# Altium project Core_FOC_F4_base.PrjPcb
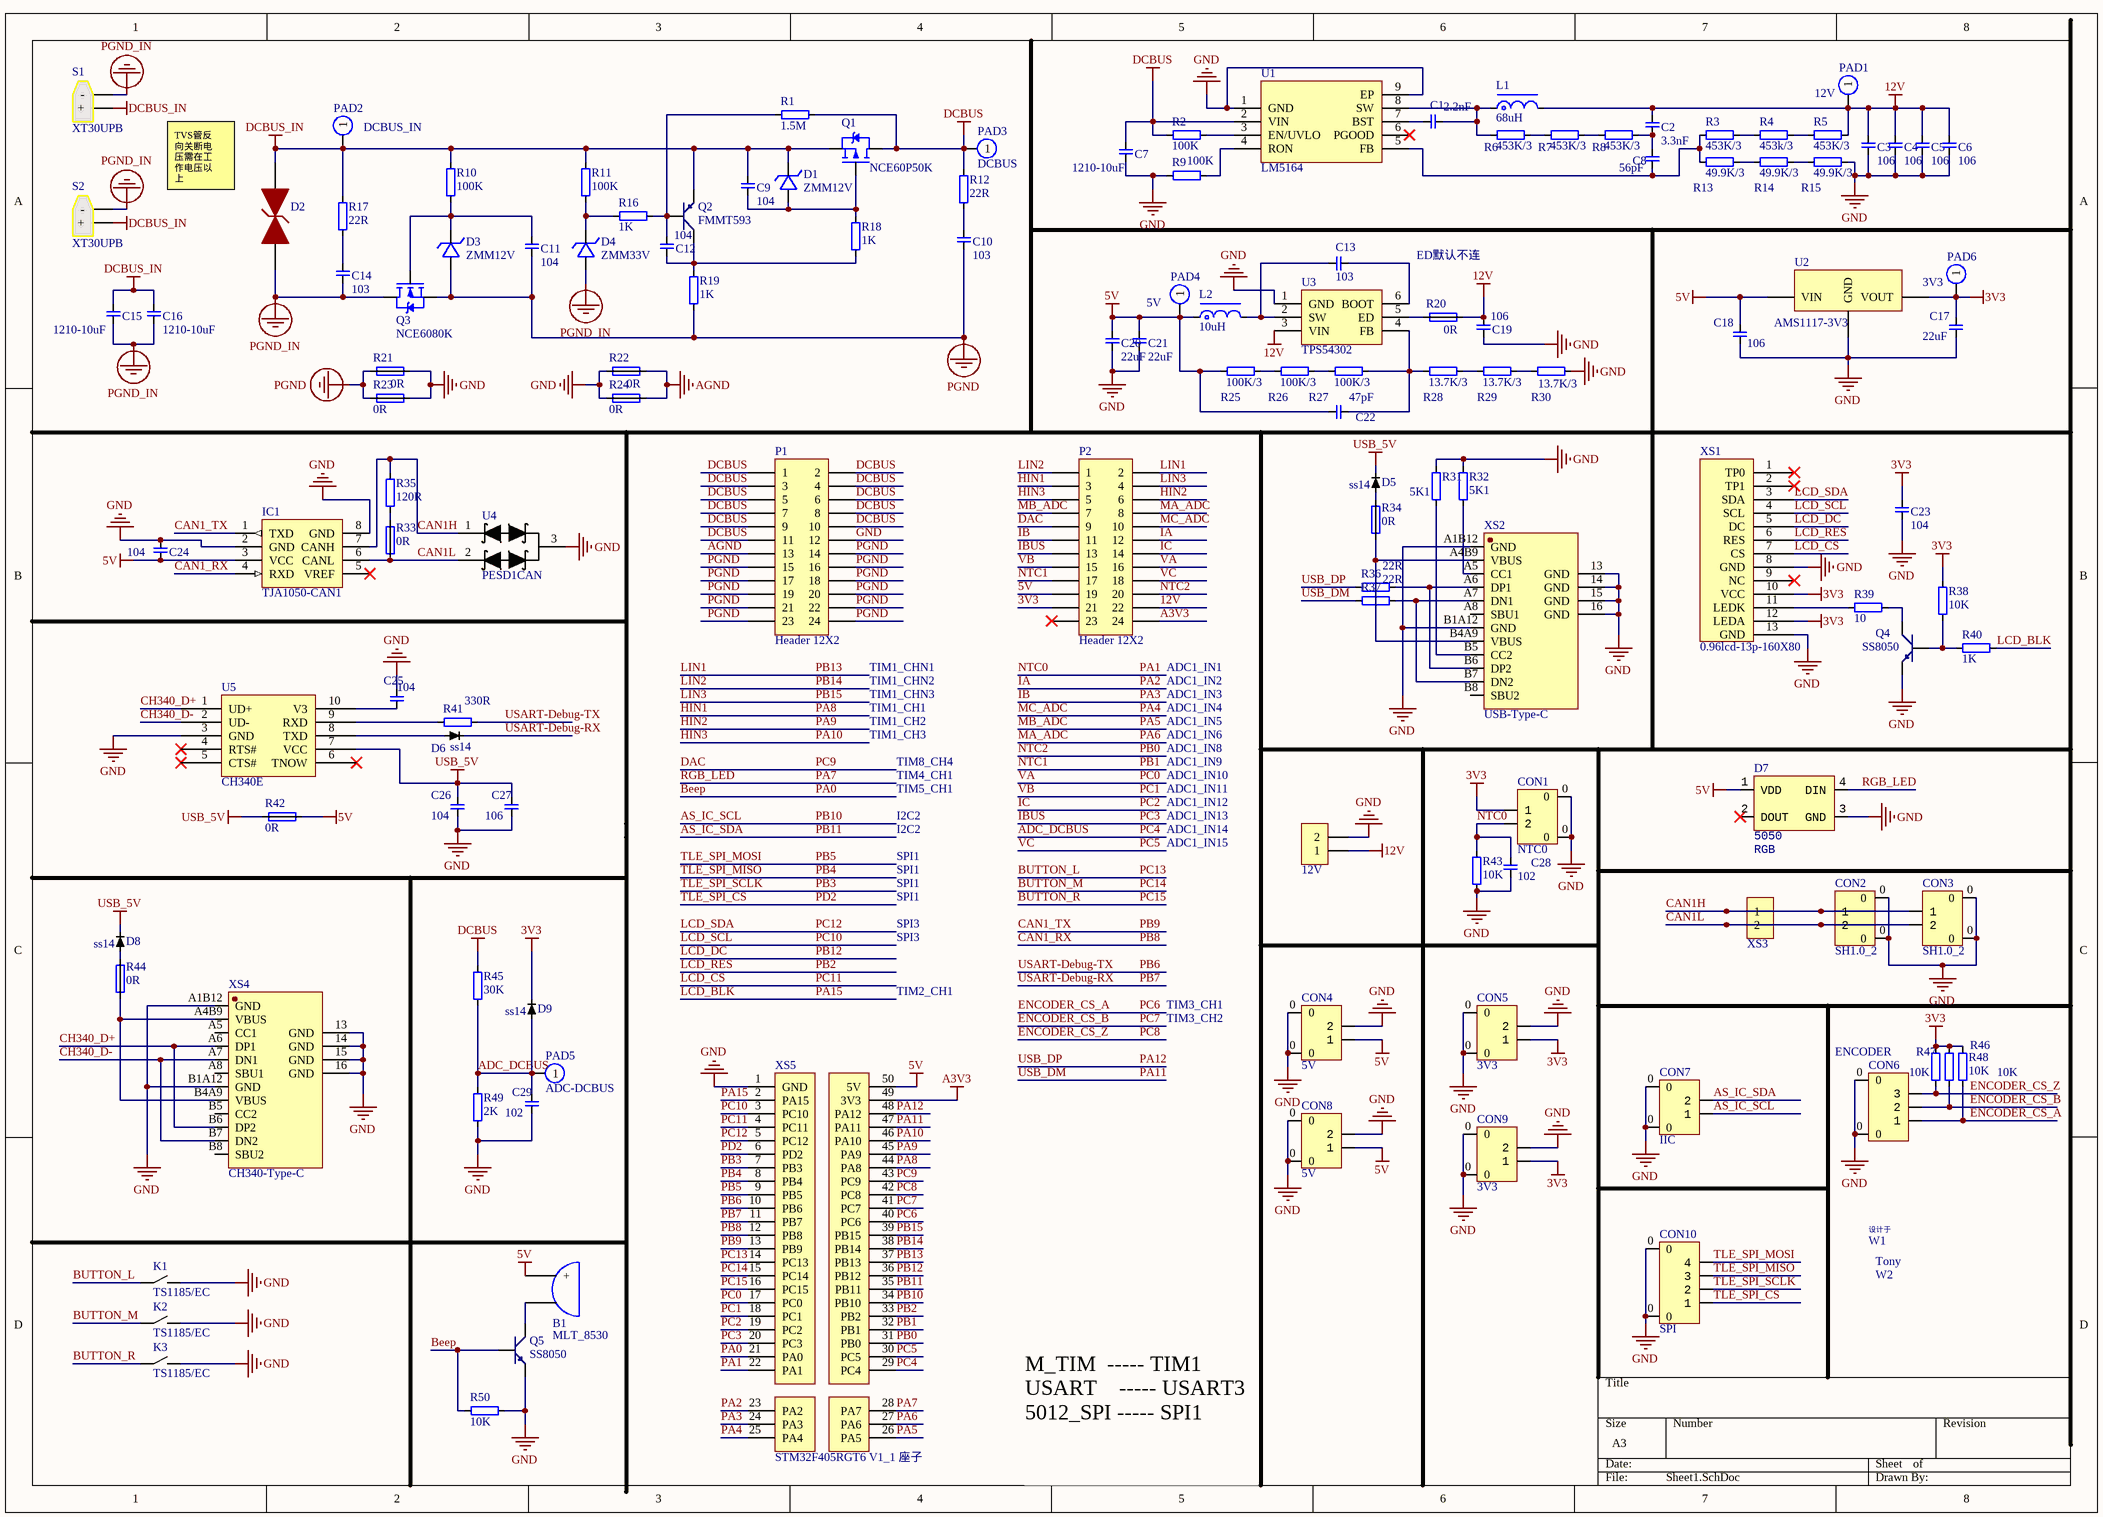
[diagram p0: Sheet1.SchDoc]
1 sheet, 133 parts. Net scope: global (net labels, ports and power ports of the same name join across sheets).
Board file: PCB1.PcbDoc

## Sheet Sheet1.SchDoc
size A3; SheetNumber: 1; SheetTotal: 1

### Parts
12V  HDR-1X2  [15EDGVM-2P]  (value not drawn)
B1  MLT_8530  [BEEP-8530]
C1  2.2nF  [CAP_0603]
C2  3.3nF  [CAP_0603]
C3  106  [CAP_0603]
C4  106  [CAP_0603]
C5  106  [CAP_0603]
C6  106  [CAP_0603]
C7  1210-10uF  [CAP_1210_L]
C8  56pF  [CAP_0603]
C9  104  [CAP_0603]
C10  103  [CAP_0603]
C11  104  [CAP_0603]
C12  104  [CAP_0603]
C13  103  [CAP_0603]
C14  103  [CAP_0603]
C15  1210-10uF  [CAP_1210_L]
C16  1210-10uF  [CAP_1210_L]
C17  22uF  [CAP_0603]
C18  106  [CAP_0603]
C19  106  [CAP_0603]
C20  22uF  [CAP_0603]
C21  22uF  [CAP_0603]
C22  47pF  [CAP_0603]
C23  104  [CAP_0603]
C24  104  [CAP_0603]
C25  104  [CAP_0603]
C26  104  [CAP_0603]
C27  106  [CAP_0603]
C28  102  [CAP_0603]
C29  102  [CAP_0603]
CON1  NTC0  [PH2.0-LS-2P]
CON2  SH1.0_2  [SH1.0 LS 2P]
CON3  SH1.0_2  [SH1.0 LS 2P]
CON4  5V  [XH2.54-LS-2P]
CON5  3V3  [ZH1.5-LS-2P]
CON6  ENCODER  [PH2.0-LS-3P]
CON7  IIC  [PH2.0-LS-2P]
CON8  5V  [XH2.54-LS-2P]
CON9  3V3  [ZH1.5-LS-2P]
CON10  SPI  [SH1.0 LS 4P]
D1  ZMM12V  [LL-34]
D2  SMBJ28CA  [SMB(DO-211AA)]  (value not drawn)
D3  ZMM12V  [LL-34]
D4  ZMM33V  [LL-34]
D5  ss14  [SOD-323]
D6  ss14  [SOD-323]
D7  Type: 5050  [LED_5050_WS2812B]  (hidden comment: RGB)
D8  ss14  [SOD-323]
D9  ss14  [SOD-323]
IC1  TJA1050-CAN1  [SOP8_N]
K1  TS1185/EC  [TS-1185EC-X-X-X]
K2  TS1185/EC  [TS-1185EC-X-X-X]
K3  TS1185/EC  [TS-1185EC-X-X-X]
L1  68uH  [NR4030]
L2  10uH  [NR3015]
P1  Header 12X2  [HDR2X12]
P2  Header 12X2  [HDR2X12]
PAD1  12V  [PAD-1]
PAD2  DCBUS_IN  [PAD-1]
PAD3  DCBUS  [PAD-1]
PAD4  5V  [PAD-1]
PAD5  ADC-DCBUS  [PAD-1]
PAD6  3V3  [PAD-1]
Q1  NCE60P50K  [TO252-2]
Q2  FMMT593  [SOT23]
Q3  NCE6080K  [TO252-2]
Q4  SS8050  [SOT23]
Q5  SS8050  [SOT23]
R1  1.5M  [RES_0603]
R2  100K  [RES_0603]
R3  453K/3  [RES_0603]
R4  453k/3  [RES_0603]
R5  453K/3  [RES_0603]
R6  453K/3  [RES_0603]
R7  453K/3  [RES_0603]
R8  453K/3  [RES_0603]
R9  100K  [RES_0603]
R10  100K  [RES_0603]
R11  100K  [RES_0603]
R12  22R  [RES_0603]
R13  49.9K/3  [RES_0603]
R14  49.9K/3  [RES_0603]
R15  49.9K/3  [RES_0603]
R16  1K  [RES_0603]
R17  22R  [RES_0603]
R18  1K  [RES_0603]
R19  1K  [RES_0603]
R20  0R  [RES_0805-SHORT]
R21  0R  [RES_0805-SHORT]
R22  0R  [RES_0805-SHORT]
R23  0R  [RES_0805-SHORT]
R24  0R  [RES_0805-SHORT]
R25  100K/3  [RES_0603]
R26  100K/3  [RES_0603]
R27  100K/3  [RES_0603]
R28  13.7K/3  [RES_0603]
R29  13.7K/3  [RES_0603]
R30  13.7K/3  [RES_0603]
R31  5K1  [RES_0603]
R32  5K1  [RES_0603]
R33  0R  [RES_0805-SHORT]
R34  0R  [RES_0805-SHORT]
R35  120R  [RES_0603]
R36  22R  [RES_0603]
R37  22R  [RES_0603]
R38  10K  [RES_0603]
R39  10  [RES_0603]
R40  1K  [RES_0603]
R41  330R  [RES_0603]
R42  0R  [RES_0805-SHORT]
R43  10K  [RES_0603]
R44  0R  [RES_0805-SHORT]
R45  30K  [RES_0603]
R46  10K  [RES_0603]
R47  10K  [RES_0603]
R48  10K  [RES_0603]
R49  2K  [RES_0603]
R50  10K  [RES_0603]
S1  XT30UPB  [XT30UPB-M]
S2  XT30UPB  [XT30UPB-F]
U1  LM5164  [SOP-8]
U2  AMS1117-3V3  [SOT223]
U3  TPS54302  [SOT23-6]
U4  PESD1CAN  [SOT23-3]
U5  CH340E  [MSOP10]
W1  设计于  [designed by（430-70）]  (value not drawn)
W2  Tony  [Tony_2(200-70)]  (value not drawn)
XS1  0.96lcd-13p-160X80  [LCD 0.96-13p]
XS2  USB-Type-C  [TypeC-304-16BCP]
XS3  HDR-1X2  [15EDGVM-2P]  (value not drawn)
XS4  CH340-Type-C  [TypeC-304-16BCP]
XS5  STM32F405RGT6 V1_1 座子  [STM32F405RGT6 V1_1座子]

### Nets
3V3: C17.2 C23.2 CON1.1 CON5.1 CON9.1 D9.2 P2.21 PAD6.1 R38.1 R46.1 R47.1 R48.1 U2.2(VOUT) XS1.10(VCC) XS1.12(LEDA)
5V: B1.1(+) C18.2 C20.1 C21.1 C22.2 C24.1 CON4.1 CON8.1 D7.1(VDD) IC1.3(VCC) L2.1 P2.19 PAD4.1 R25.2 R42.1 U2.3(VIN) XS5.50(5V)
12V: 12V.1 C2.1 C3.1 C4.1 C5.1 C6.1 C19.2 L1.2 P2.22 PAD1.1 R5.2 R20.2 U3.3(VIN)
A3V3: P2.24 XS5.49(3V3)
AGND: P1.13 R22.2 R24.2
DCBUS: C7.2 P1.1 P1.2 P1.3 P1.4 P1.5 P1.6 P1.7 P1.8 P1.9 P1.10 P1.11 PAD3.1 Q1.2(D) R1.1 R2.2 R12.2 R45.2 U1.2(VIN)
DCBUS_IN: C9.2 C15.2 C16.2 D1.2 D2.2 PAD2.1 Q1.3(S) Q2.1(E) R10.2 R11.2 R17.2 S1.1(+) S2.1(+)
GND: 12V.2 C3.2 C4.2 C5.2 C6.2 C7.1 C17.1 C18.1 C19.1 C20.2 C21.2 C23.1 C24.2 C25.2 C26.1 C27.1 C28.1 C29.1 CON1.0 CON2.0 CON3.0 CON4.0 CON4.2 CON5.0 CON5.2 CON6.0 CON7.0 CON8.0 CON8.2 CON9.0 CON9.2 CON10.0 D7.3(GND) IC1.2(GND) IC1.8(GND) K1.2 K2.2 K3.2 P1.12 Q4.2(E) Q5.2(E) R9.2 R15.1 R21.2 R22.1 R23.2 R24.1 R30.1 R31.2 R32.2 R43.2 R49.1 R50.1 U1.1(GND) U1.9(EP) U2.1(GND) U3.1(GND) U4.3 U5.3(GND) XS1.8(GND) XS1.13(GND) XS2.13(GND) XS2.14(GND) XS2.15(GND) XS2.16(GND) XS2.A1B12(GND) XS2.B1A12(GND) XS4.13(GND) XS4.14(GND) XS4.15(GND) XS4.16(GND) XS4.A1B12(GND) XS4.B1A12(GND) XS5.1(GND)
PGND: C10.1 C11.1 D3.1 P1.14 P1.15 P1.16 P1.17 P1.18 P1.19 P1.20 P1.21 P1.22 P1.23 P1.24 Q3.3(S) R19.1 R21.1 R23.1
PGND_IN: C14.1 C15.1 C16.1 D2.1 D4.1 Q3.2(D) S1.2(-) S2.2(-)
USB_5V: C26.2 C27.2 D5.2 D8.2 R42.2 U5.7(VCC)
ADC_DCBUS: C29.2 D9.1 PAD5.1 R45.1 R49.2 XS5.29(PC4)  [also labelled PC4]
AS_IC_SCL: CON7.1 XS5.34(PB10)  [also labelled PB10]
AS_IC_SDA: CON7.2 XS5.35(PB11)  [also labelled PB11]
Beep: Q5.1(B) R50.2 XS5.21(PA0)  [also labelled PA0]
BUTTON_L: K1.1 XS5.14(PC13)  [also labelled PC13]
BUTTON_M: K2.1 XS5.15(PC14)  [also labelled PC14]
BUTTON_R: K3.1 XS5.16(PC15)  [also labelled PC15]
CAN1_RX: IC1.4(RXD) XS5.12(PB8)  [also labelled PB8]
CAN1_TX: IC1.1(TXD) XS5.13(PB9)  [also labelled PB9]
CAN1H: CON2.1 CON3.1 IC1.7(CANH) R35.2 U4.1 XS3.1
CAN1L: CON2.2 CON3.2 IC1.6(CANL) R33.2 U4.2 XS3.2
CH340_D+: U5.1(UD+) XS4.A6(DP1) XS4.B6(DP2)
CH340_D-: U5.2(UD-) XS4.A7(DN1) XS4.B7(DN2)
DAC: P2.9 XS5.43(PC9)  [also labelled PC9]
ENCODER_CS_A: CON6.1 R48.2 XS5.40(PC6)  [also labelled PC6]
ENCODER_CS_B: CON6.2 R46.2 XS5.41(PC7)  [also labelled PC7]
ENCODER_CS_Z: CON6.3 R47.2 XS5.42(PC8)  [also labelled PC8]
HIN1: P2.3 XS5.44(PA8)  [also labelled PA8]
HIN2: P2.6 XS5.45(PA9)  [also labelled PA9]
HIN3: P2.5 XS5.46(PA10)  [also labelled PA10]
IA: P2.12 XS5.23(PA2)  [also labelled PA2]
IB: P2.11 XS5.24(PA3)  [also labelled PA3]
IBUS: P2.13 XS5.20(PC3)  [also labelled PC3]
IC: P2.14 XS5.19(PC2)  [also labelled PC2]
LCD_BLK: R40.2 XS5.2(PA15)  [also labelled PA15]
LCD_CS: XS1.7(CS) XS5.4(PC11)  [also labelled PC11]
LCD_DC: XS1.5(DC) XS5.36(PB12)  [also labelled PB12]
LCD_RES: XS1.6(RES) XS5.33(PB2)  [also labelled PB2]
LCD_SCL: XS1.4(SCL) XS5.3(PC10)  [also labelled PC10]
LCD_SDA: XS1.3(SDA) XS5.5(PC12)  [also labelled PC12]
LIN1: P2.2 XS5.37(PB13)  [also labelled PB13]
LIN2: P2.1 XS5.38(PB14)  [also labelled PB14]
LIN3: P2.4 XS5.39(PB15)  [also labelled PB15]
MA_ADC: P2.8 XS5.27(PA6)  [also labelled PA6]
MB_ADC: P2.7 XS5.26(PA5)  [also labelled PA5]
MC_ADC: P2.10 XS5.25(PA4)  [also labelled PA4]
NTC0: C28.2 CON1.2 R43.1 XS5.22(PA1)  [also labelled PA1]
NTC1: P2.17 XS5.32(PB1)  [also labelled PB1]
NTC2: P2.20 XS5.31(PB0)  [also labelled PB0]
PA7: D7.4(DIN) XS5.28(PA7)  [also labelled RGB_LED]
PA11: R37.1 XS5.47(PA11)  [also labelled USB_DM]
PA12: R36.1 XS5.48(PA12)  [also labelled USB_DP]
PB3: CON10.2 XS5.7(PB3)  [also labelled TLE_SPI_SCLK]
PB4: CON10.3 XS5.8(PB4)  [also labelled TLE_SPI_MISO]
PB5: CON10.4 XS5.9(PB5)  [also labelled TLE_SPI_MOSI]
PB6: R41.2 XS5.10(PB6)  [also labelled USART-Debug-TX]
PB7: D6.1 XS5.11(PB7)  [also labelled USART-Debug-RX]
PC0: P2.16 XS5.17(PC0)  [also labelled VA]
PC1: P2.15 XS5.18(PC1)  [also labelled VB]
PC5: P2.18 XS5.30(PC5)  [also labelled VC]
PD2: CON10.1 XS5.6(PD2)  [also labelled TLE_SPI_CS]
NetB1_2: B1.2(-) Q5.3(C)
NetC1_1: C1.1 L1.1 R6.2 U1.8(SW)
NetC1_2: C1.2 U1.7(BST)
NetC2_2: C2.2 C8.1 R8.1
NetC8_2: C8.2 R3.1 R13.2 U1.5(FB)
NetC9_1: C9.1 D1.1 Q1.1(G) R18.2
NetC10_2: C10.2 R12.1
NetC11_2: C11.2 D3.2 Q3.1(G) R10.1
NetC12_1: C12.1 Q2.3(C) R18.1 R19.2
NetC12_2: C12.2 Q2.2(B) R1.2 R16.1
NetC13_1: C13.1 U3.6(BOOT)
NetC13_2: C13.2 L2.2 U3.2(SW)
NetC14_2: C14.2 R17.1
NetC22_1: C22.1 R27.1 R28.2 U3.4(FB)
NetC25_1: C25.1 U5.10(V3)
NetD4_2: D4.2 R11.1 R16.2
NetD5_1: D5.1 R34.2
NetD6_2: D6.2 U5.8(TXD)
NetD8_1: D8.1 R44.2
NetQ4_1: Q4.1(B) R38.2 R40.1
NetQ4_3: Q4.3(C) R39.2
NetR2_1: R2.1 U1.3(EN/UVLO)
NetR3_2: R3.2 R4.1
NetR4_2: R4.2 R5.1
NetR6_1: R6.1 R7.2
NetR7_1: R7.1 R8.2
NetR9_1: R9.1 U1.4(RON)
NetR13_1: R13.1 R14.2
NetR14_1: R14.1 R15.2
NetR20_1: R20.1 U3.5(ED)
NetR25_1: R25.1 R26.2
NetR26_1: R26.1 R27.2
NetR28_1: R28.1 R29.2
NetR29_1: R29.1 R30.2
NetR31_1: R31.1 XS2.B5(CC2)
NetR32_1: R32.1 XS2.A5(CC1)
NetR33_1: R33.1 R35.1
NetR34_1: R34.1 XS2.A4B9(VBUS) XS2.B4A9(VBUS)
NetR36_2: R36.2 XS2.A6(DP1) XS2.B6(DP2)
NetR37_2: R37.2 XS2.A7(DN1) XS2.B7(DN2)
NetR39_1: R39.1 XS1.11(LEDK)
NetR41_1: R41.1 U5.9(RXD)
NetR44_1: R44.1 XS4.A4B9(VBUS) XS4.B4A9(VBUS)

Not connected (* = marked no-connect by the designer): D7 2(DOUT)*; IC1 5(VREF)*; P2 23*; U1 6(PGOOD)*; U5 4(RTS#)* 5(CTS#)* 6(TNOW)*; XS1 1(TP0)* 2(TP1)* 9(NC)*; XS2 A8(SBU1) B8(SBU2); XS4 A5(CC1) A8(SBU1) B5(CC2) B8(SBU2)

### Notes on the sheet
- (near D2) TVS管反
  向关断电
  压需在工
  作电压以
  上
- ED默认不连
- TIM1_CHN1
- TIM1_CHN2
- TIM1_CHN3
- TIM1_CH1
- TIM1_CH2
- (near P2) ADC1_IN1
- ADC1_IN2
- ADC1_IN3
- ADC1_IN4
- ADC1_IN5
- TIM1_CH3
- TIM8_CH4
- TIM4_CH1
- TIM5_CH1
- ADC1_IN6
- ADC1_IN8
- ADC1_IN9
- ADC1_IN10
- ADC1_IN11
- I2C2
- SPI1
- ADC1_IN12
- ADC1_IN13
- ADC1_IN14
- ADC1_IN15
- SPI3
- TIM2_CH1
- TIM3_CH1
- TIM3_CH2
- M_TIM  ----- TIM1
  USART    ----- USART3
  5012_SPI ----- SPI1

### Library data of the parts
12V XS3 = Header 2: 2P接插件; 版权归属: 源创客; BOM名称: 2P接插件; 学习资源: www.ooocke.com
B1 = Beep
C1-C29 = cap
CON1 CON7 = PH2.0_2: PH2.0_2 座子
CON2 CON3 = SH1.0_2: SH1.0 座子
CON4 CON8 = XH2.54_2: XH2.54_2 座子
CON5 CON9 = ZH1.5_2: ZH1.5_2 座子
CON6 = PH2.0_3: PH2.0 座子
CON10 = SH1.0_4: SH1.0 座子
D1 D3 D4 = ZD: Zener Diodes 稳压二极管
D2 = TVS: 瞬态电压抑制二极管(TVS) 钳位二极管
D5 D6 D8 D9 = Diode
D7 = RGB_4WIC: LED; Value: RGB
IC1 = TJA1050: CAN总线收发芯片; 版权归属: 源创客; BOM名称: CAN总线收发芯片; 学习资源: www.ooocke.com
K1-K3 = Button-LT-3040: 3*4*2 立贴轻触开关 2Pin/4Pin
L1 L2 = INDUCTOR
P1 P2 = Header 12X2: Header, 12-Pin, Dual row; LatestRevisionDate: 17-Jul-2002; LatestRevisionNote: Re-released for DXP Platform.; Publisher: Altium Limited
PAD1-PAD6 = PAD: 50mil单点焊盘，用于测试
Q1 = PMOS: N沟道MOSFIT / -NCE60P50K-TO252-2
Q2 = PNP
Q3 = NMOS: N沟道MOSFIT / -NCE6080K-TO252-2
Q4 Q5 = NPN
R1-R19 R25-R32 R35-R41 R43 R45-R50 = Res
R20-R24 R33 R34 R42 R44 = Res-SHORT
S1 S2 = XT30UPB: XT30UPB-I/O
U1 = LM5164: DC-DC芯片; ComponentLink1Description: 供应商链接; ComponentLink1URL: http://www.szlcsc.com/product/details_10396.html; Package: SOP-8_EP_150mil; Supplier: LC; SuppliersPartNumber: C9864
U2 = AMS1117
U3 = TPS54302: 12V稳压5VDCDC
U4 = PESD1CAN: CAN过压保护,放于外部接口端
U5 = CH340E: USB转串口 无外置晶振
XS1 = 0.96lcd-13p: 焊接屏幕
XS2 XS4 = Type-C母口